# EAGLE design hvreg_feedback_3PS (EAGLE 7.2.0)
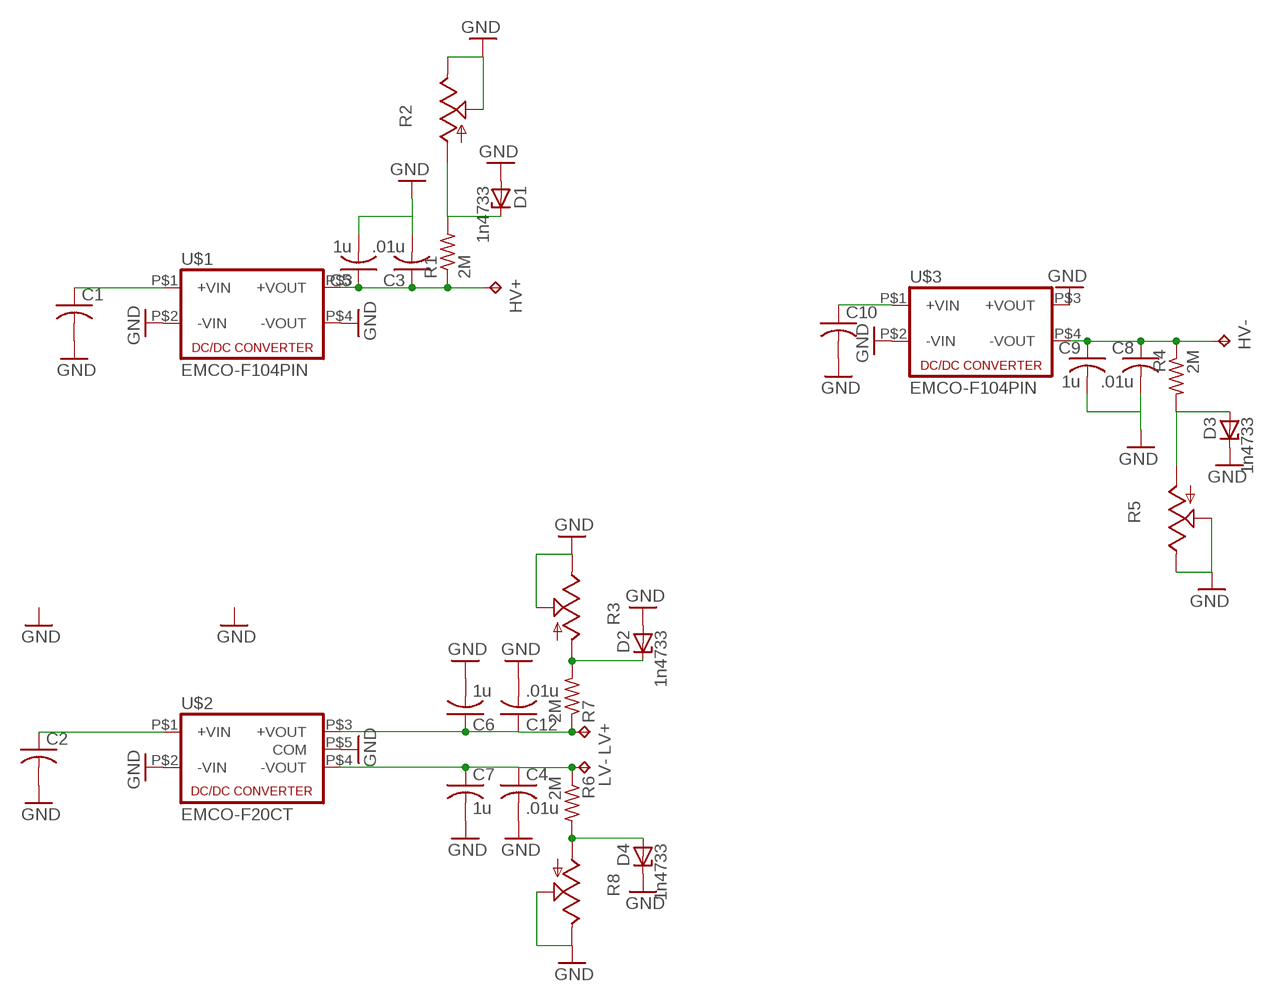
[diagram p0: schematic, sheet 1]

## Parts
C1  C-US050-030X075  [C050-030X075]
C2  C-US050-030X075  [C050-030X075]
C3  .01u  C-US075-042X103  [C075-042X103]
C4  .01u  C-US075-042X103  [C075-042X103]
C5  1u  C-US225-108X268  [C225-108X268]
C6  1u  C-US225-108X268  [C225-108X268]
C7  1u  C-US225-108X268  [C225-108X268]
C8  .01u  C-US075-042X103  [C075-042X103]
C9  1u  C-US225-108X268  [C225-108X268]
C10  C-US050-030X075  [C050-030X075]
C12  .01u  C-US075-042X103  [C075-042X103]
D1  1n4733  ZENER-DIODEZD-10  [ZDIO-10]
D2  1n4733  ZENER-DIODEZD-10  [ZDIO-10]
D3  1n4733  ZENER-DIODEZD-10  [ZDIO-10]
D4  1n4733  ZENER-DIODEZD-10  [ZDIO-10]
HV+  TPPAD1-20Y  [P1-20Y]
HV-  TPPAD1-20Y  [P1-20Y]
LV+  TPPAD1-20Y  [P1-20Y]
LV-  TPPAD1-20Y  [P1-20Y]
R1  2M  R-US_0207/12  [0207/12]
R2  TRIM_US-B90P  [SP19L]
R3  TRIM_US-B90P  [SP19L]
R4  2M  R-US_0207/12  [0207/12]
R5  TRIM_US-B90P  [SP19L]
R6  2M  R-US_0207/12  [0207/12]
R7  2M  R-US_0207/12  [0207/12]
R8  TRIM_US-B90P  [SP19L]
U$1  EMCO-F104PIN  [EMCO-F]
U$2  EMCO-F20CT  [EMCO-F*CT]
U$3  EMCO-F104PIN  [EMCO-F]

## Nets
GND: C1.2 C2.2 C3.2 C4.2 C5.2 C6.2 C7.2 C8.2 C9.2 C10.2 C12.2 D1.A D2.A D3.C D4.C R2.E R2.S R3.E R3.S R5.E R5.S R8.E R8.S U$1.P$2(-VIN) U$1.P$4(-VOUT) U$2.P$2(-VIN) U$2.P$5(COM) U$3.P$2(-VIN) U$3.P$3(+VOUT)
N$1: C3.1 C5.1 HV+.TP R1.1 U$1.P$3(+VOUT)
N$2: C6.1 C12.1 LV+.TP R7.1 U$2.P$3(+VOUT)
N$3: D1.C R1.2 R2.A
N$4: C1.1 U$1.P$1(+VIN)
N$5: C2.1 U$2.P$1(+VIN)
N$6: C4.1 C7.1 LV-.TP R6.1
N$7: C8.1 C9.1 HV-.TP R4.1
N$8: D2.C R3.A R7.2
N$9: D3.A R4.2 R5.A
N$10: C10.1 U$3.P$1(+VIN)
N$11: D4.A R6.2 R8.A
Unconnected: U$2.P$4(-VOUT) U$3.P$4(-VOUT)

## Library data of the parts
C1-C10 C12 = rcl:C-US: CAPACITOR, American symbol
D1-D4 = diode:ZENER-DIODE: Z-Diode
HV+ HV- LV+ LV- = testpad:TP: Test pad
R1 R4 R6 R7 = resistor:R-US_: RESISTOR, American symbol
R2 R3 R5 R8 = pot:TRIM_US-: POTENTIOMETER
U$1 U$3 = dc-dc-converter:EMCO-F10
U$2 = dc-dc-converter:EMCO-F20CT

## Board
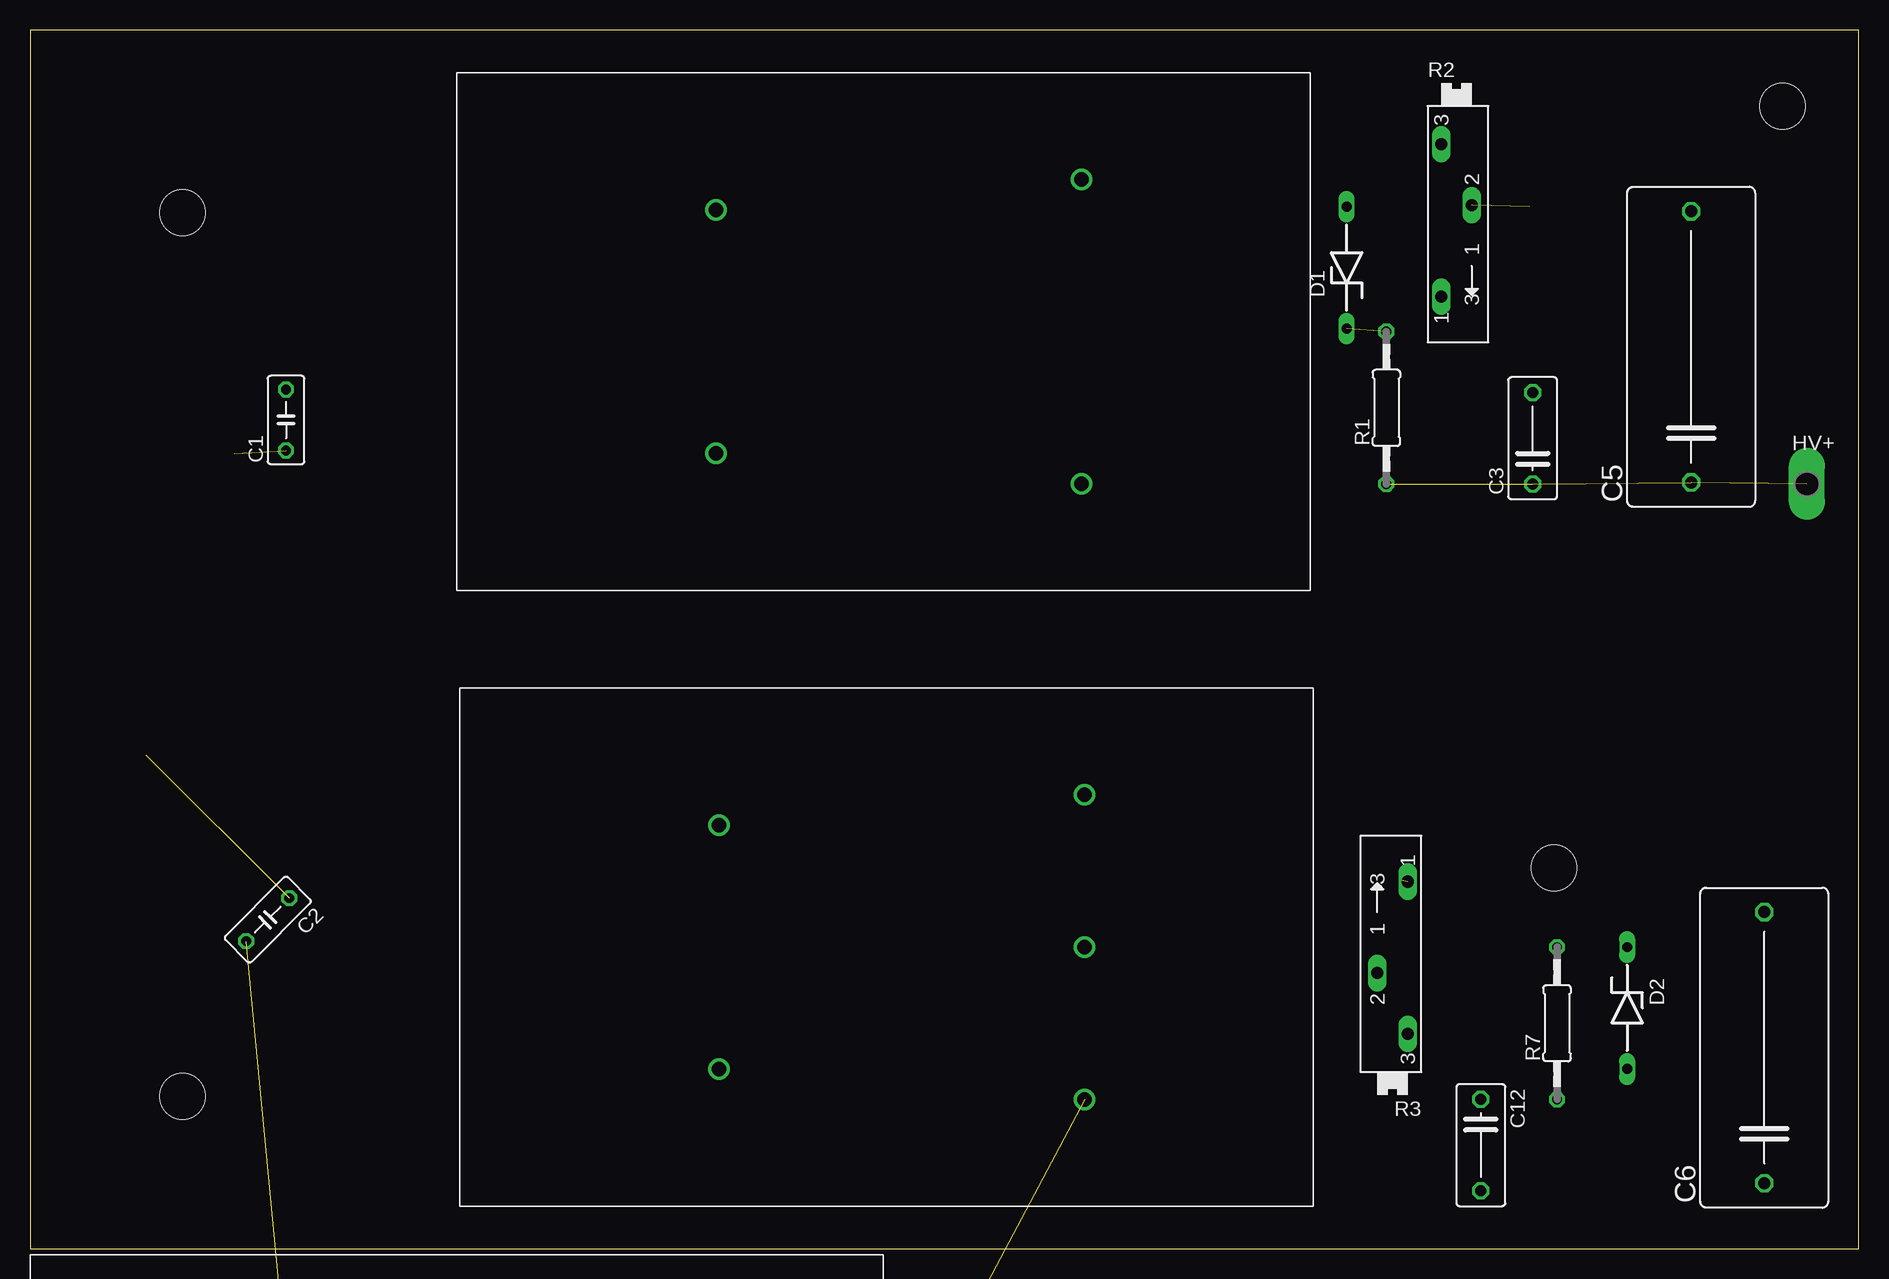
[diagram p1: board, top side]
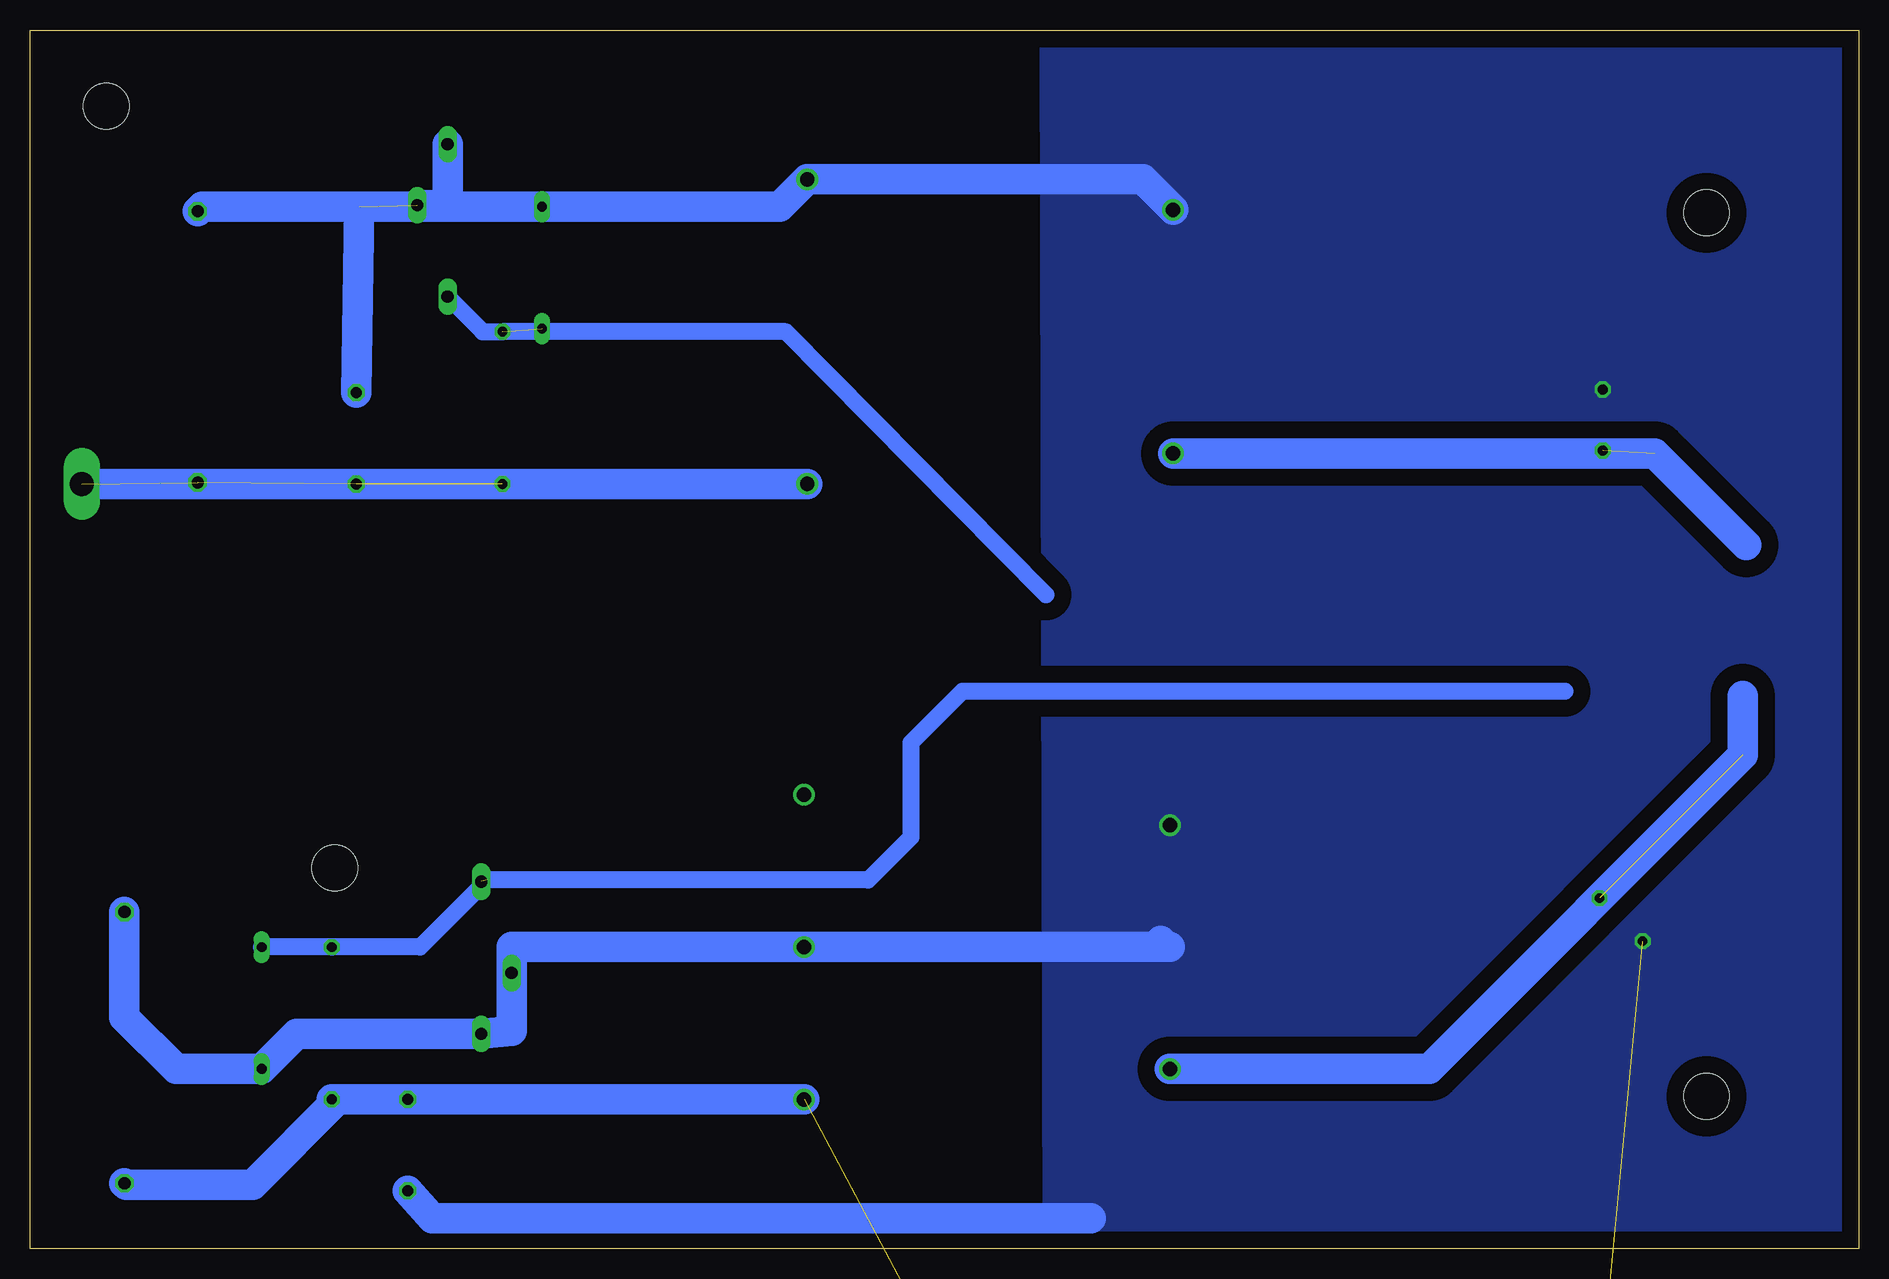
[diagram p2: board, bottom side, seen from below]

Size 152.4 x 101.62 mm. Coordinates in mm from the lower left corner, seen from the top.
Outline: 0,0.02 152.4,0 152.4,101.62 0,101.62 0,0.02
Copper layers (1*16): Top 0.035mm / dielectric 1.5mm / Bottom 0.035mm
Design rules "default": minimum track width 10mil, minimum drill 24mil, track to track 8mil, track to pad 8mil, pad to pad 8mil, via to via 8mil, smd to smd 8mil, copper to edge 40mil, drill to drill 8mil, minimum pad ring 10mil, minimum via ring 8mil, stop-mask expansion 4mil, vias tented up to drill 0mil, thermal gap 10mil
Holes 3.8 mm at 127,31.77 146.05,95.27 12.7,12.72 12.7,86.38

### Footprints (pad centres in the part's own frame; a part is rotated, then mirrored left to right if it is on the bottom)
C050-030X075 = drill 0.813 octagon: 1 -2.54,0; 2 2.54,0
C075-042X103 = drill 0.914 octagon: 1 -3.81,0; 2 3.81,0
C225-108X268 = drill 1.016 octagon: 1 -11.303,0; 2 11.303,0
ZDIO-10 = drill 0.813 long: A 5.08,0; C -5.08,0
P1-20Y = drill 2.007 pad 2.54 long: TP 0,0
0207/12 = drill 0.813 octagon: 1 -6.35,0; 2 6.35,0
SP19L = drill 1.016 long: A 5.715,-1.27; E -6.985,-1.27; S -1.905,1.27
EMCO-F = drill 1.2: P$1 0,0; P$2 0,20.32; P$3 30.48,-2.54; P$4 30.48,22.86
EMCO-F*CT = drill 1.2: P$1 0,0; P$2 0,20.32; P$3 30.48,-2.54; P$4 30.48,22.86; P$5 30.48,10.16

### Placement (x,y rotation side)
C1  21.34,69.11 90 top
C2  19.81,27.45 225 top
C3  125.22,67.58 90 top
C4  5.08,-118.34 0 top  (outside the outline)
C5  138.43,75.2 90 top
C6  144.53,16.78 90 top
C7  13.46,-98.53 0 top  (outside the outline)
C8  19.56,-71.86 0 top  (outside the outline)
C9  13.46,-52.05 0 top  (outside the outline)
C10  4.06,-88.63 0 top  (outside the outline)
C12  120.9,8.66 270 top
D1  109.73,81.81 90 top
D2  133.1,20.09 270 top
D3  7.11,-134.35 0 top  (outside the outline)
D4  7.11,-141.46 0 top  (outside the outline)
HV+  148.08,63.77 0 top
HV-  16,-61.96 0 top  (outside the outline)
LV+  1.78,-149.59 0 top  (outside the outline)
LV-  1.78,-157.46 0 top  (outside the outline)
R1  113.03,70.12 90 top
R2  118.87,85.11 270 top
R3  113.54,24.91 90 top
R4  7.37,-83.8 0 top  (outside the outline)
R5  14.22,-77.7 0 top  (outside the outline)
R6  7.37,-129.52 0 top  (outside the outline)
R7  127.25,18.82 90 top
R8  14.22,-123.42 0 top  (outside the outline)
U$1  57.15,66.31 0 top
U$2  57.4,15.01 0 top
U$3  21.59,-32.24 0 top  (outside the outline)

### Tracks (layer width: path | path; a pad name or v marks a point on that pad's centre or on a via)
GND  (14 unrouted)
  Bottom 2.54: U$1.P$2 59.69,89.17 U$1.P$4 89.92,86.89 D1.A 124.97,86.89 | C3.2 124.97,86.89 | 58.17,25.17 58.17,25.67 | 57.4,25.17 U$2.P$5 112.27,25.17 R3.S 112.27,18.18 R3.E 130.18,17.93 D2.A 140.21,15.01 144.53,19.32 C6.2 | 64.01,2.56 118.87,2.56 C12.2 | C5.2 138.05,86.89 124.97,86.89 | R2.S 117.6,87.02 R2.E
  pour Bottom (isolate 1.422, no thermals): 0,101.37 68.07,101.62 67.82,0.02 0,0.02
N$1  (3 unrouted)
  Bottom 2.54: U$1.P$3 HV+.TP
N$2  (1 unrouted)
  Bottom 2.54: U$2.P$3 C12.1 126.49,12.47 126.75,12.47 | R7.1 126.75,12.47 | C6.1 144.4,5.35 133.86,5.35 126.75,12.47
N$3  (1 unrouted)
  Bottom 1.422: 67.71,54.53 89.41,76.47 R1.2 114.68,76.47 R2.A
N$4  (1 unrouted)
  Bottom 2.54: 9.4,58.69 17.02,66.31 U$1.P$1
N$5  (1 unrouted)
  Bottom 2.54: 9.65,46.1 9.65,41.17 35.81,15.01 U$2.P$1
N$6  (3 unrouted)
N$7  (3 unrouted)
N$8  (1 unrouted)
  Bottom 1.422: 24.49,46.5 74.68,46.5 78.99,42.18 78.99,34.31 82.55,30.75 114.3,30.75 119.89,25.17 R7.2 D2.C
N$9  (2 unrouted)
N$10  (1 unrouted)
N$11  (2 unrouted)